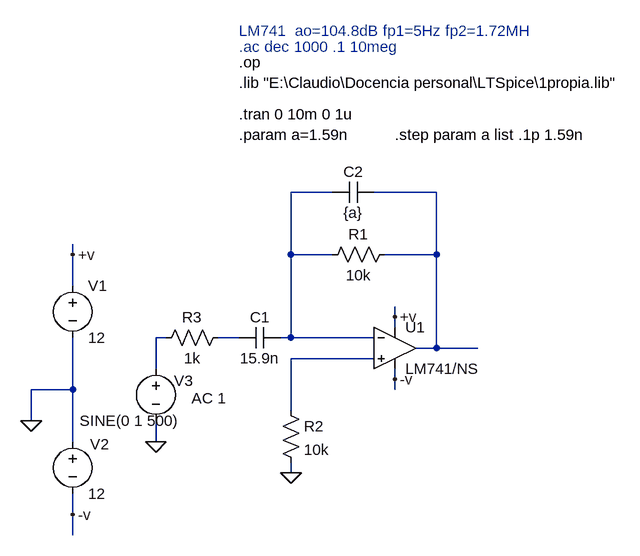
[diagram p0: schematic derivador2.asc]
derivador2.asc, the LTspice schematic file:
Version 4
SHEET 1 880 680
WIRE 192 -80 128 -80
WIRE 352 -80 256 -80
WIRE -208 16 -208 0
WIRE 128 16 128 -80
WIRE 192 16 128 16
WIRE 352 16 352 -80
WIRE 352 16 272 16
WIRE -208 64 -208 16
WIRE 288 112 288 96
WIRE 288 128 288 112
WIRE -64 144 -80 144
WIRE 48 144 16 144
WIRE 128 144 128 16
WIRE 128 144 112 144
WIRE 256 144 128 144
WIRE 352 160 352 16
WIRE 352 160 320 160
WIRE 416 160 352 160
WIRE 256 176 128 176
WIRE -80 192 -80 144
WIRE 288 208 288 192
WIRE -208 224 -208 144
WIRE -208 224 -272 224
WIRE 288 224 288 208
WIRE 128 256 128 176
WIRE -272 272 -272 224
WIRE -208 304 -208 224
WIRE -80 304 -80 272
WIRE 128 352 128 336
WIRE -208 416 -208 384
WIRE -208 448 -208 416
FLAG -272 272 0
FLAG -208 16 +v
FLAG -208 416 -v
FLAG 288 112 +v
FLAG 288 208 -v
FLAG 128 352 0
FLAG -80 304 0
SYMBOL OpAmps\\opamp2 288 96 R0
SYMATTR InstName U1
SYMATTR Value LM741/NS
SYMBOL voltage -208 48 R0
WINDOW 123 0 0 Left 0
WINDOW 39 0 0 Left 0
SYMATTR InstName V1
SYMATTR Value 12
SYMBOL voltage -208 288 R0
WINDOW 0 27 20 Left 2
WINDOW 123 0 0 Left 0
WINDOW 39 0 0 Left 0
SYMATTR InstName V2
SYMATTR Value 12
SYMBOL res 288 0 R90
WINDOW 0 0 56 VBottom 2
WINDOW 3 32 56 VTop 2
SYMATTR InstName R1
SYMATTR Value 10k
SYMBOL cap 112 128 R90
WINDOW 0 0 32 VBottom 2
WINDOW 3 32 32 VTop 2
SYMATTR InstName C1
SYMATTR Value 15.9n
SYMBOL res 112 240 R0
SYMATTR InstName R2
SYMATTR Value 10k
SYMBOL voltage -80 176 R0
WINDOW 0 28 34 Left 2
WINDOW 3 -117 96 Left 2
WINDOW 123 55 61 Left 2
WINDOW 39 0 0 Left 0
SYMATTR InstName V3
SYMATTR Value SINE(0 1 500)
SYMATTR Value2 AC 1
SYMBOL res 32 128 R90
WINDOW 0 0 56 VBottom 2
WINDOW 3 32 56 VTop 2
SYMATTR InstName R3
SYMATTR Value 1k
SYMBOL cap 256 -96 R90
WINDOW 0 0 32 VBottom 2
WINDOW 3 32 32 VTop 2
SYMATTR InstName C2
SYMATTR Value {a}
TEXT 48 -248 Left 2 !.lib "E:\\Claudio\\Docencia personal\\LTSpice\\1propia.lib"
TEXT 48 -280 Left 2 !.op
TEXT 48 -304 Left 2 ;.ac dec 1000 .1 10meg
TEXT 48 -328 Left 2 ;LM741  ao=104.8dB fp1=5Hz fp2=1.72MH
TEXT 48 -200 Left 2 !.tran 0 10m 0 1u
TEXT 48 -168 Left 2 !.param a=1.59n
TEXT 288 -168 Left 2 !.step param a list .1p 1.59n

The netlist it stands for:
* derivador2.asc
XU1 N005 N001 +v -v N002 LM741/NS  ; pins In+ In- V+ V- OUT
V1 +v 0 12
V2 0 -v 12
R1 N002 N001 10k
C1 N001 N004 15.9n
R2 N005 0 10k
V3 N003 0 SINE(0 1 500) AC 1
R3 N004 N003 1k
C2 N002 N001 {a}
.lib "E:\Claudio\Docencia personal\LTSpice\1propia.lib"
.op
* .ac dec 1000 .1 10meg
* LM741  ao=104.8dB fp1=5Hz fp2=1.72MH
.tran 0 10m 0 1u
.param a=1.59n
.step param a list .1p 1.59n
.backanno
.end